# EAGLE design loadSwitchBreakoutBoard (EAGLE 8.5.0)
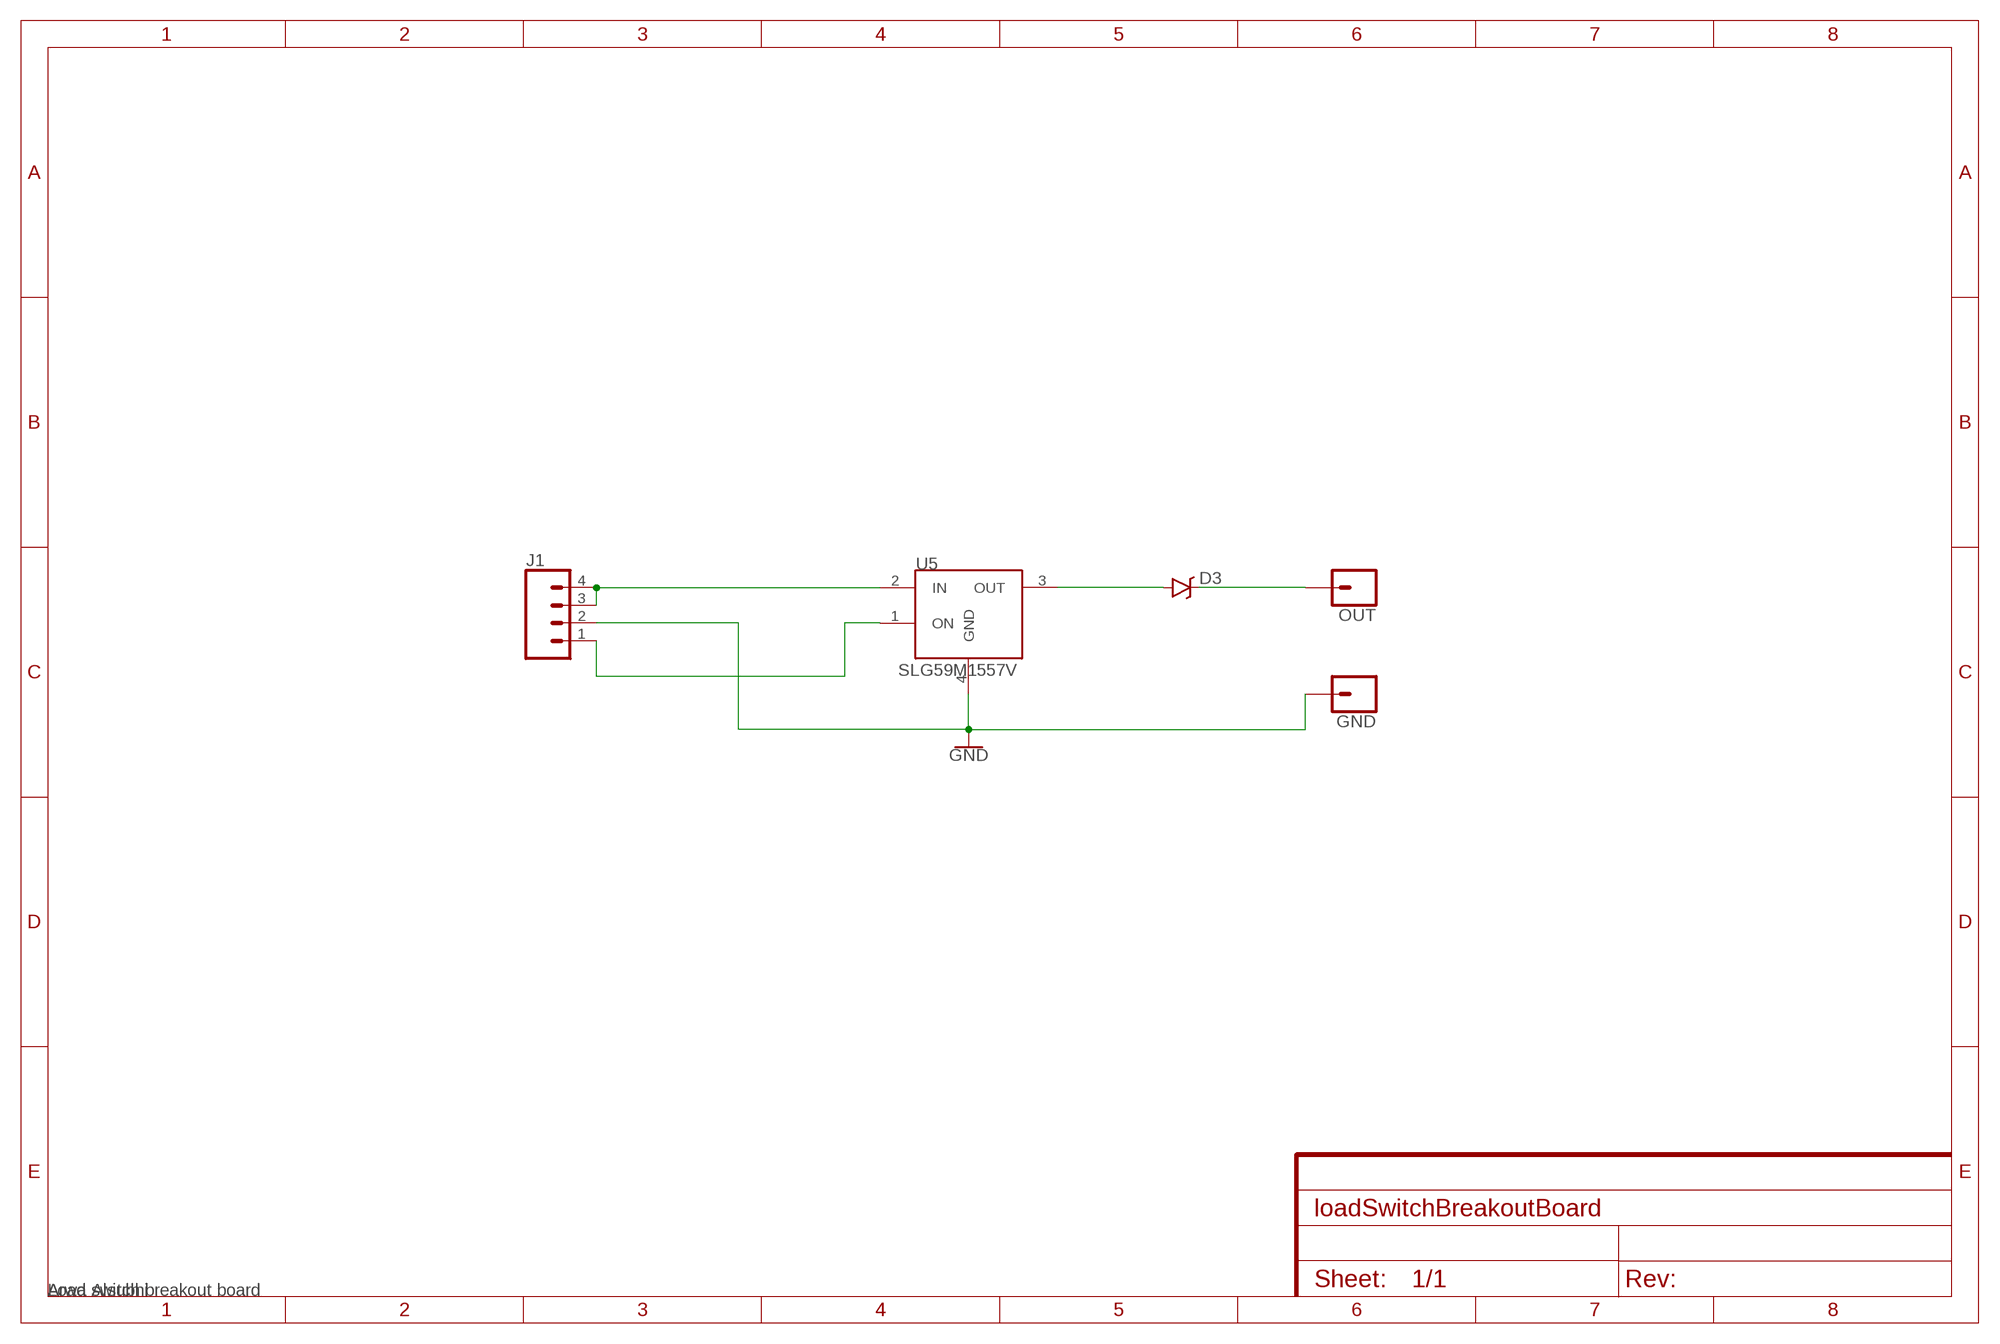
[diagram p0: schematic, sheet 1]
FRAME1 (FRAME-A4L): CNAME: Load switch breakout board; CREVISION: A; DESIGNER: Arwa Alsubhi

## Parts
D3  RB751  DIODE-SCHOTTKY-RB751  [SOD-523]
GND  CONN_01  [1X01]
J1  CONN_04  [1X04]
OUT  CONN_01  [1X01]
U5  SLG59M1557V  [4STDFN]

## Nets
GND: GND.1 J1.2 U5.4(GND)
IN: J1.3 J1.4 U5.2(IN)
N$1: D3.A U5.3(OUT)
N$2: D3.C OUT.1
ON: J1.1 U5.1(ON)

## Library data of the parts
D3 = SparkFun-DiscreteSemi:DIODE-SCHOTTKY: Schottky diodes in SFE's production catalog BAT20J 1A 23V 0.62Vf RB751 120mA 40V 0.37Vf PMEG4005EJ 0.5A 40V 0.42Vf MBRA140 1A 40V 0.5Vf B340A 3A 40V SMA; DIGIKEY: BAS40-02V-V-G-08GICT-ND; MPN: BAS40-02V-V-G-08; PROD_ID: DIO-11018
GND OUT = SparkFun-Connectors:CONN_01: Single connection point. Often used as Generic Header-pin footprint for 0.1 inch spaced/style header connections On any of the 0.1 inch spaced packages, you can populate with these: Break Away Headers - Straight <https://www.sparkfun.com/products/116> (PRT-00116) Break Away Male Headers - Right Angle <https://www.sparkfun.com/products/553> (PRT-00553) Female Headers <https://www.sparkfun.com/products/115> (PRT-00115) Break Away Headers - Machine Pin <https://www.sparkfun.com/products/117> (PRT-00117) Break Away Female Headers - Swiss Machine Pin <https://www.sparkfun.com/products/743> (PRT-00743) This device is also useful as a general connection point to wire up your design to another part of your project. Our various solder wires solder well into these plated through hole pads. Hook-Up Wire - Assortment (Stranded, 22 AWG) <https://www.sparkfun.com/products/11375> (PRT-11375) Hook-Up Wire - Assortment (Solid Core, 22 AWG) <https://www.sparkfun.com/products/11367> (PRT-11367) View the entire wire category on our website here <https://www.sparkfun.com/categories/141> Special notes: SMTSO-256-ET is a "flush mount" nut for a 4-40 screw. We mostly use this on specialty testbeds; it is a nice way to connect hardware to your PCB at an adjustable hieght. Also note, the SNAP packages are for using a snappable style connector. We sell a baggie of snaps and they are also used on two LilyPad designs: Snap Assortment - 30 pack (male and female) <https://www.sparkfun.com/products/11347> (DEV-11347) LilyPad Arduino SimpleSnap <https://www.sparkfun.com/products/10941> (DEV-10941) LilyPad SimpleSnap Protoboard <https://www.sparkfun.com/products/10940> (DEV-10940)
J1 = SparkFun-Connectors:CONN_04: Multi connection point. Often used as Generic Header-pin footprint for 0.1 inch spaced/style header connections On any of the 0.1 inch spaced packages, you can populate with these: Break Away Headers - Straight <https://www.sparkfun.com/products/116> (PRT-00116) Break Away Male Headers - Right Angle <https://www.sparkfun.com/products/553> (PRT-00553) Female Headers <https://www.sparkfun.com/products/115> (PRT-00115) Break Away Headers - Machine Pin <https://www.sparkfun.com/products/117> (PRT-00117) Break Away Female Headers - Swiss Machine Pin <https://www.sparkfun.com/products/743> (PRT-00743) For SCREWTERMINALS and SPRING TERMINALS visit here: Screw Terimnals on SparkFun.com <https://www.sparkfun.com/search/results?term=Screw+Terminals> (5mm/3.5mm/2.54mm spacing) This device is also useful as a general connection point to wire up your design to another part of your project. Our various solder wires solder well into these plated through hole pads. Hook-Up Wire - Assortment (Stranded, 22 AWG) <https://www.sparkfun.com/products/11375> (PRT-11375) Hook-Up Wire - Assortment (Solid Core, 22 AWG) <https://www.sparkfun.com/products/11367> (PRT-11367) View the entire wire category on our website here <https://www.sparkfun.com/categories/141> Special notes: Molex polarized connector foot print use with SKU : PRT-08231 with associated crimp pins and housings. 1MM SMD Version SKU: PRT-10208; PROD_ID: CONN-09696
U5 = loadswitches:SLG59M1557V: SILEGO SLG59M1557V: Ultra-small 28.5 mΩ, 1.0 A Integrated Power Switch with Discharge The SLG59M1557V is designed for load switching applications with ultra low quiescent current (20nA), and low turn on voltage (0.85V). The part comes with one 28.5 mΩ 1.0 A rated P-channel MOSFET controlled by a single ON control pin. The product is packaged in an ultra-small 1.0 x 1.0 mm package.; MANAFACTURER: SLG59M1557V; MOUSER: 402-SLG59M1557V; MPN: SLG59M1557V

## Board
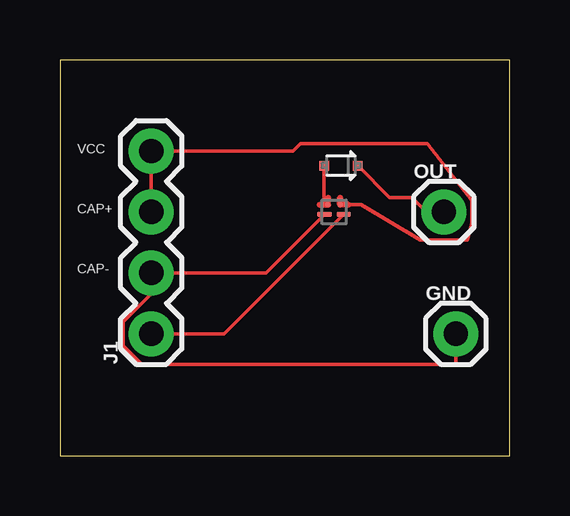
[diagram p1: board, top side]

Size 18.76 x 16.5 mm. Coordinates in mm from the lower left corner, seen from the top.
Outline: 0,0 18.76,0 18.76,16.5 0,16.5 0,0
Copper layers (1*16): Top 0.035mm / dielectric 1.5mm / Bottom 0.035mm
Design rules "default": minimum track width 6mil, minimum drill 0.35mm, track to track 6mil, track to pad 6mil, pad to pad 6mil, via to via 6mil, smd to smd 6mil, copper to edge 40mil, drill to drill 6mil, minimum pad ring 10mil, minimum via ring 8mil, stop-mask expansion 4mil, vias tented up to drill 0mil, thermal gap 10mil

### Footprints (pad centres in the part's own frame; a part is rotated, then mirrored left to right if it is on the bottom)
SOD-523 = smd 0.4 x 0.4: A -0.7,0; C 0.7,0
1X01 = drill 1.016 pad 1.88: 1 0,0
1X04 = drill 1.016 pad 1.88: 1 0,0; 2 2.54,0; 3 5.08,0; 4 7.62,0
4STDFN = smd 0.6 x 0.2: 1 -0.4,0.1; 4 0.4,0.1 | smd 0.152 x 0.152: 2 -0.25,-0.3; 3 0.25,-0.3

### Placement (x,y rotation side)
D3  11.72,12.09 0 top
GND  16.51,5.08 0 top
J1  3.81,5.08 90 top
OUT  16.01,10.16 0 top
U5  11.43,10.16 180 top

### Tracks (layer width: path | path; a pad name or v marks a point on that pad's centre or on a via)
GND
  Top 0.152: U5.4 8.59,7.62 J1.2 3.81,6.73 2.64,5.56 2.64,4.6 3.43,3.81 16.51,3.81 GND.1
IN
  Top 0.152: J1.3 J1.4 9.73,12.7 10.03,13.01 15.32,13.01 17.18,10.64 17.18,9.68 16.99,8.99 15.03,8.99 12.56,10.46 U5.2
N$1
  Top 0.152: D3.A 11.02,10.62 U5.3
N$2
  Top 0.152: D3.C 13.74,10.77 14.68,10.77 15.29,10.16 OUT.1
ON
  Top 0.152: U5.1 6.85,5.08 J1.1

### Text on the board
tNames: VCC | CAP+ | CAP-
bNames: Arwa Alsubhi / Clemson University / load switch breakout board - rev A